# Altium schematic sheet NB2_CommonMemory_128Mb_Flash.SchDoc: Common-Bus Memory Block
size A4; Organization: Altium Limited.; Address1: Level 3, 12a Rodborough Rd; Address2: Frenchs Forest 2086; Address3: NSW; Address4: AUSTRALIA; SheetNumber: 1; SheetTotal: 100; PageSetup: Record=PageOptions|CenterHorizontal=True|CenterVertical=True|PrintScale=0.97|XCorrection=1.00|YCorrection=1.00|PrintKind=0|BorderSize=5000000|LeftOffset=0|BottomOffset=0|Orientation=2|PaperLength=1000|PaperWidth=1000|Scale=100|PaperSource=7|PrintQuality=-4|MediaType=1|DitherType=10|PaperKind=A3 (297 x 420mm)|PrintScaleMode=1
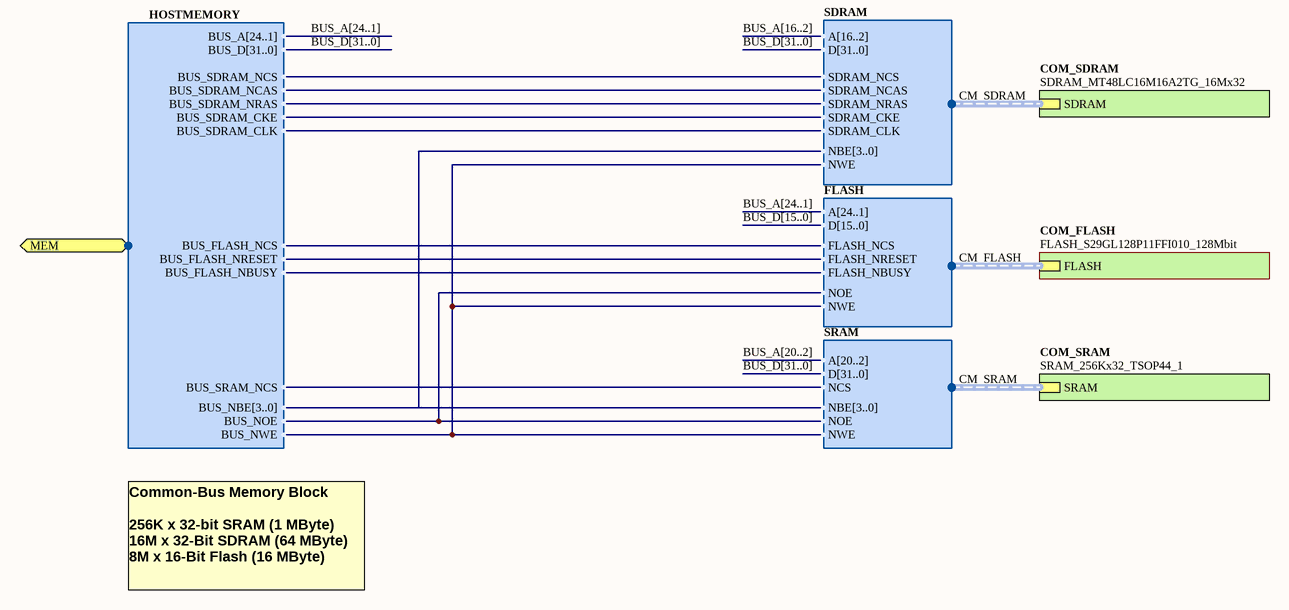
[diagram p0: NB2_CommonMemory_128Mb_Flash.SchDoc]

## Sub-sheets
COM_FLASH = FLASH_S29GL128P11FFI010_128Mbit: FLASH (harness FLASH)
COM_SDRAM = SDRAM_MT48LC16M16A2TG_16Mx32: SDRAM (harness SDRAM)
COM_SRAM = SRAM_256Kx32_TSOP44_1: SRAM (harness SRAM)

## Ports
MEM (harness HOSTMEMORY)

## Harnesses
SRAM: A[20..2], D[31..0], NCS, NWE, NOE, NBE[3..0]
FLASH: D[15..0], A[24..1], FLASH_NCS, NOE, NWE, FLASH_NRESET, FLASH_NBUSY
SDRAM: A[16..2], D[31..0], NBE[3..0], NWE, SDRAM_NCAS, SDRAM_NRAS, SDRAM_CKE, SDRAM_CLK, SDRAM_NCS
HOSTMEMORY: BUS_A[24..1], BUS_D[31..0], BUS_NOE, BUS_NWE, BUS_NBE[3..0], BUS_SRAM_NCS, BUS_FLASH_NCS, BUS_SDRAM_NCS, BUS_SDRAM_CKE, BUS_SDRAM_CLK, BUS_SDRAM_NCAS, BUS_SDRAM_NRAS, BUS_FLASH_NRESET, BUS_FLASH_NBUSY

## Nets
CM_FLASH.FLASH_NBUSY: sheet COM_FLASH/FLASH.FLASH_NBUSY, port MEM.BUS_FLASH_NBUSY
CM_FLASH.FLASH_NCS: sheet COM_FLASH/FLASH.FLASH_NCS, port MEM.BUS_FLASH_NCS
CM_FLASH.FLASH_NRESET: sheet COM_FLASH/FLASH.FLASH_NRESET, port MEM.BUS_FLASH_NRESET
CM_FLASH.NOE: sheet COM_SRAM/SRAM.NOE, sheet COM_FLASH/FLASH.NOE, port MEM.BUS_NOE
CM_FLASH.NWE: sheet COM_SRAM/SRAM.NWE, sheet COM_FLASH/FLASH.NWE, sheet COM_SDRAM/SDRAM.NWE, port MEM.BUS_NWE
CM_SDRAM.SDRAM_CKE: sheet COM_SDRAM/SDRAM.SDRAM_CKE, port MEM.BUS_SDRAM_CKE
CM_SDRAM.SDRAM_CLK: sheet COM_SDRAM/SDRAM.SDRAM_CLK, port MEM.BUS_SDRAM_CLK
CM_SDRAM.SDRAM_NCAS: sheet COM_SDRAM/SDRAM.SDRAM_NCAS, port MEM.BUS_SDRAM_NCAS
CM_SDRAM.SDRAM_NCS: sheet COM_SDRAM/SDRAM.SDRAM_NCS, port MEM.BUS_SDRAM_NCS
CM_SDRAM.SDRAM_NRAS: sheet COM_SDRAM/SDRAM.SDRAM_NRAS, port MEM.BUS_SDRAM_NRAS
CM_SRAM.NCS: sheet COM_SRAM/SRAM.NCS, port MEM.BUS_SRAM_NCS

## Buses and harness runs
bus BUS_A[16..2]
bus BUS_A[20..2]
bus BUS_A[24..1]
bus BUS_D[15..0]
bus BUS_D[31..0]
harness CM_FLASH = sheet COM_FLASH/FLASH
harness CM_SDRAM = sheet COM_SDRAM/SDRAM
harness CM_SRAM = sheet COM_SRAM/SRAM

## Notes on the sheet
- Common-Bus Memory Block
  256K x 32-bit SRAM (1 MByte)
  16M x 32-Bit SDRAM (64 MByte)
  8M x 16-Bit Flash (16 MByte)
- Sheet Title
- Project Title
- Size:
- Date:
- A4
- Assy:
- Time:
- Revision:
- Sheet
- of
- File: